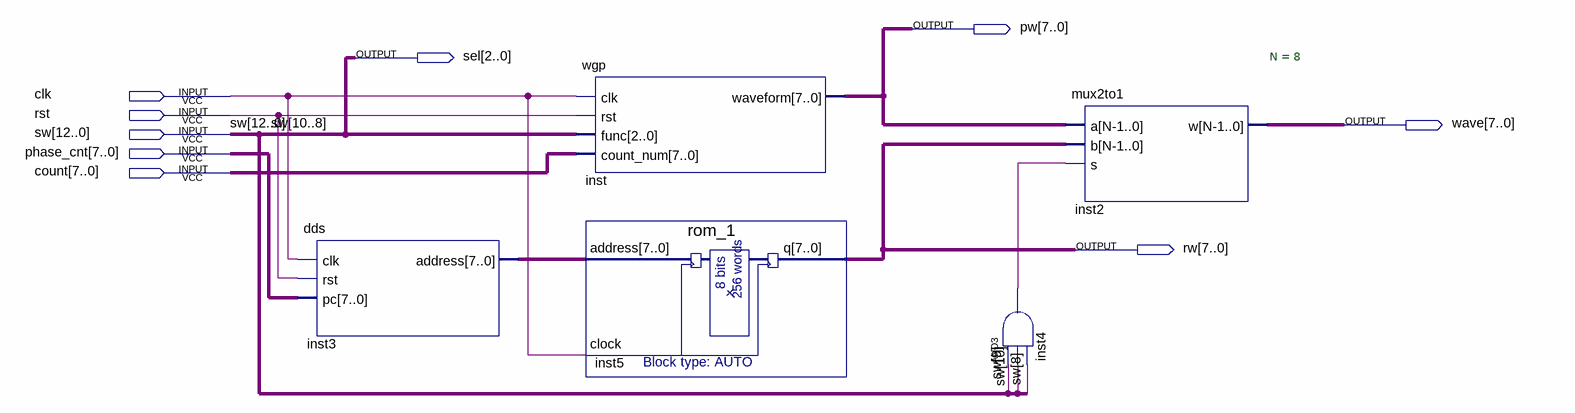
[diagram p0: schematic sheet]
// Quartus schematic wg.bdf as structural Verilog: 5 symbols, 9 pins
module wg (
  input  clk,
  input  rst,
  input  [12:0] sw,
  input  [7:0] phase_cnt,
  input  [7:0] count,
  output [7:0] pw,
  output [2:0] sel,
  output [7:0] wave,
  output [7:0] rw
);

  wire inst4_out;
  wire [7:0] inst3_address;

  dds inst3 (.clk(clk), .rst(rst), .pc(phase_cnt), .address(inst3_address));
  wgp inst (.clk(clk), .rst(rst), .func(sw[10:8]), .count_num(count), .waveform(pw));
  rom_1 inst5 (.address(inst3_address), .clock(clk), .q(rw));
  and inst4 (inst4_out, sw[9], sw[10], sw[8]);
  mux2to1 #(.N(8)) inst2 (.a(pw), .b(rw), .s(inst4_out), .w(wave));

  assign sel = sw[10:8];
endmodule
